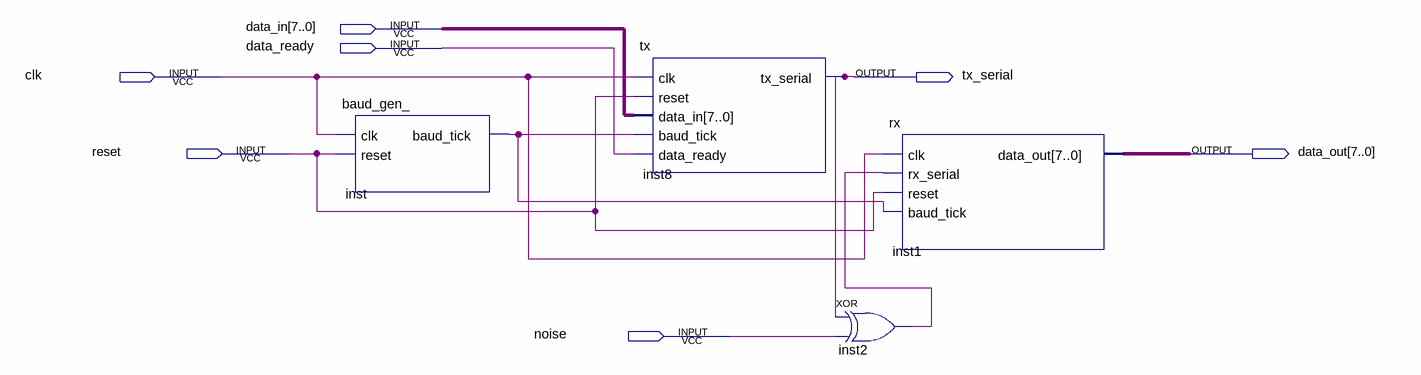
[diagram p0: schematic sheet]
// Quartus schematic top.bdf as structural Verilog: 4 symbols, 7 pins
module top (
  input  [7:0] data_in,
  input  data_ready,
  input  clk,
  input  reset,
  input  noise,
  output tx_serial,
  output [7:0] data_out
);

  wire inst2_out, inst_baud_tick;

  baud_gen_ inst (.clk(clk), .reset(reset), .baud_tick(inst_baud_tick));
  tx inst8 (
    .clk(clk), .reset(reset), .data_in(data_in), .baud_tick(inst_baud_tick), .data_ready(data_ready),
    .tx_serial(tx_serial));
  xor inst2 (inst2_out, tx_serial, noise);
  rx inst1 (.clk(clk), .rx_serial(inst2_out), .reset(reset), .baud_tick(inst_baud_tick), .data_out(data_out));
endmodule
